# EAGLE schematic tivac-shield-power-board (EAGLE 7.1.0)
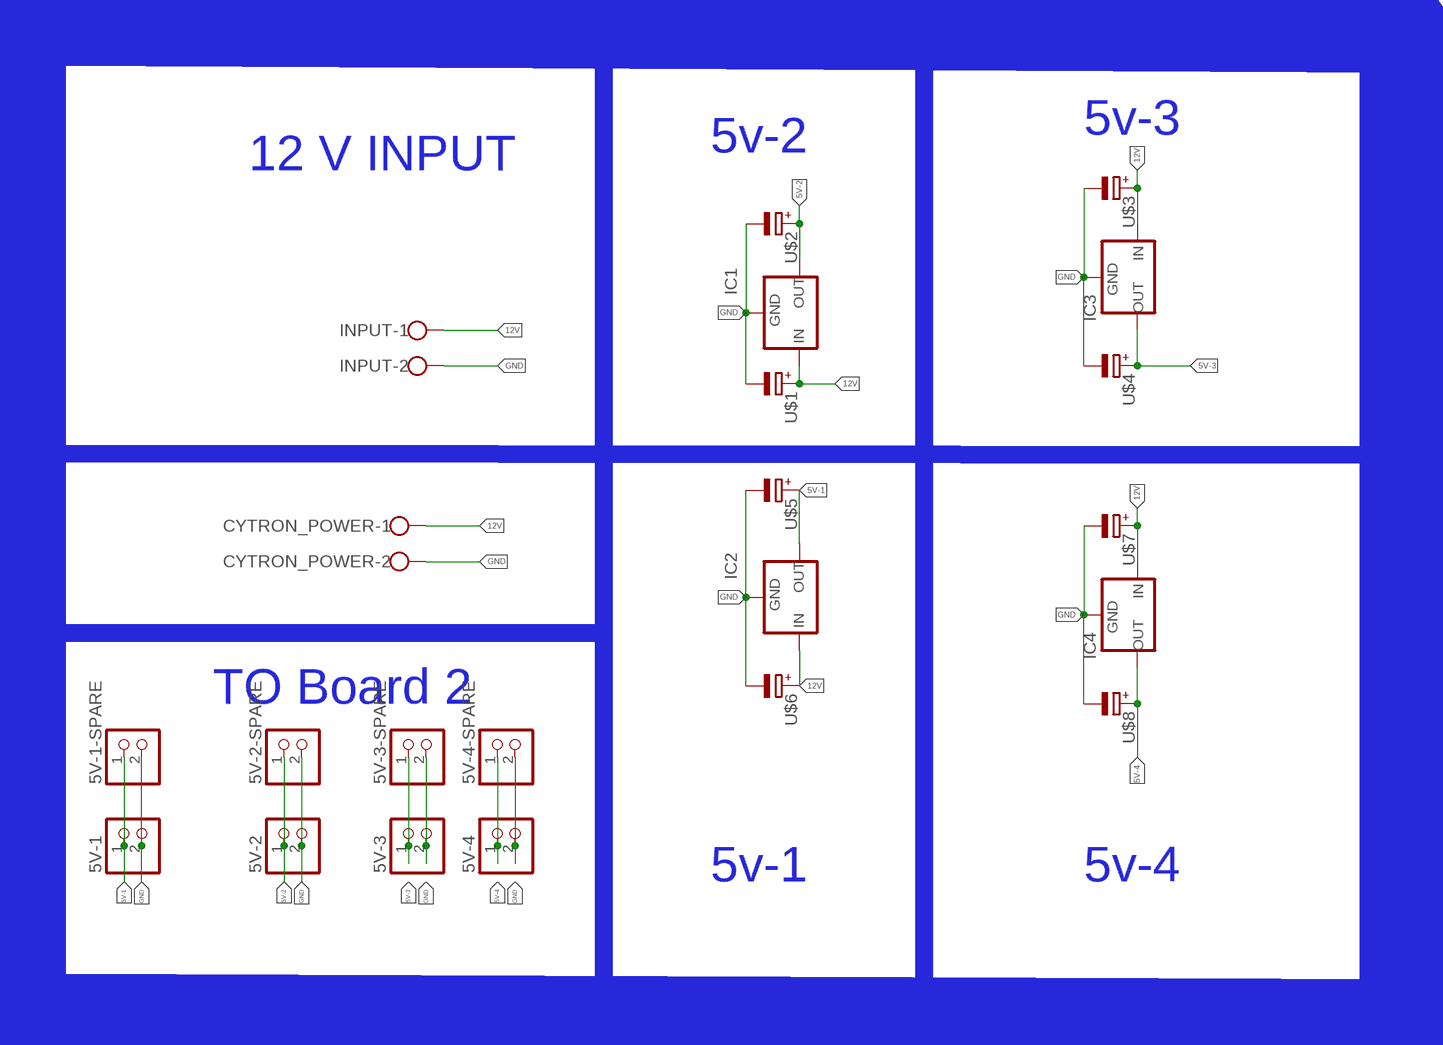
[diagram p0: schematic, sheet 1]

## Parts
5V-1  PINHD-1X2  [1X02]
5V-1-SPARE  PINHD-1X2  [1X02]
5V-2  PINHD-1X2  [1X02]
5V-2-SPARE  PINHD-1X2  [1X02]
5V-3  PINHD-1X2  [1X02]
5V-3-SPARE  PINHD-1X2  [1X02]
5V-4  PINHD-1X2  [1X02]
5V-4-SPARE  PINHD-1X2  [1X02]
CYTRON_POWER  W237-113  [W237-113]
IC1  78XX-METAL  [TO3-79]
IC2  78XX-METAL  [TO3-79]
IC3  78XXS  [78XXS]
IC4  78XXS  [78XXS]
INPUT  W237-113  [W237-113]
U$1  CAP_POL  [E3,5-8]
U$2  CAP_POL  [E3,5-8]
U$3  CAP_POL  [E3,5-8]
U$4  CAP_POL  [E3,5-8]
U$5  CAP_POL  [E3,5-8]
U$6  CAP_POL  [E3,5-8]
U$7  CAP_POL  [E3,5-8]
U$8  CAP_POL  [E3,5-8]

## Nets
5V-1: 5V-1-SPARE.1 5V-1.1 IC2.1(OUT) U$5.+
5V-2: 5V-2-SPARE.1 5V-2.1 IC1.1(OUT) U$2.+
5V-3: 5V-3-SPARE.1 5V-3.1 IC3.OUT U$4.+
5V-4: 5V-4-SPARE.1 5V-4.1 IC4.OUT U$8.+
12V: CYTRON_POWER.1 IC1.3(IN) IC2.3(IN) IC3.IN IC4.IN INPUT.1 U$1.+ U$3.+ U$6.+ U$7.+
GND: 5V-1-SPARE.2 5V-1.2 5V-2-SPARE.2 5V-2.2 5V-3-SPARE.2 5V-3.2 5V-4-SPARE.2 5V-4.2 CYTRON_POWER.2 IC1.2(GND) IC2.2(GND) IC3.GND IC4.GND INPUT.2 U$1.- U$2.- U$3.- U$4.- U$5.- U$6.- U$7.- U$8.-

## Notes on the sheet
- 5v-3
- 5v-2
- 12 V INPUT
- TO Board 2
- 5v-1 | 5v-4

## Library data of the parts
5V-1 5V-1-SPARE 5V-2 5V-2-SPARE 5V-3 5V-3-SPARE 5V-4 5V-4-SPARE = pinhead:PINHD-1X2: PIN HEADER
CYTRON_POWER INPUT = con-wago-500:W237-113: WAGO SCREW CLAMP; OC_FARNELL: unknown; OC_NEWARK: unknown
IC1 IC2 = MIA_LIBRARY-2-2-2:78XX-METAL: VOLTAGE REGULATOR
IC3 IC4 = MIA_LIBRARY-2-2-2:78XXS: VOLTAGE REGULATOR
U$1-U$8 = MIA_LIBRARY-2-2-2:CAP_POL